# EAGLE design unicycle_v2.3 (EAGLE 9.6.1)
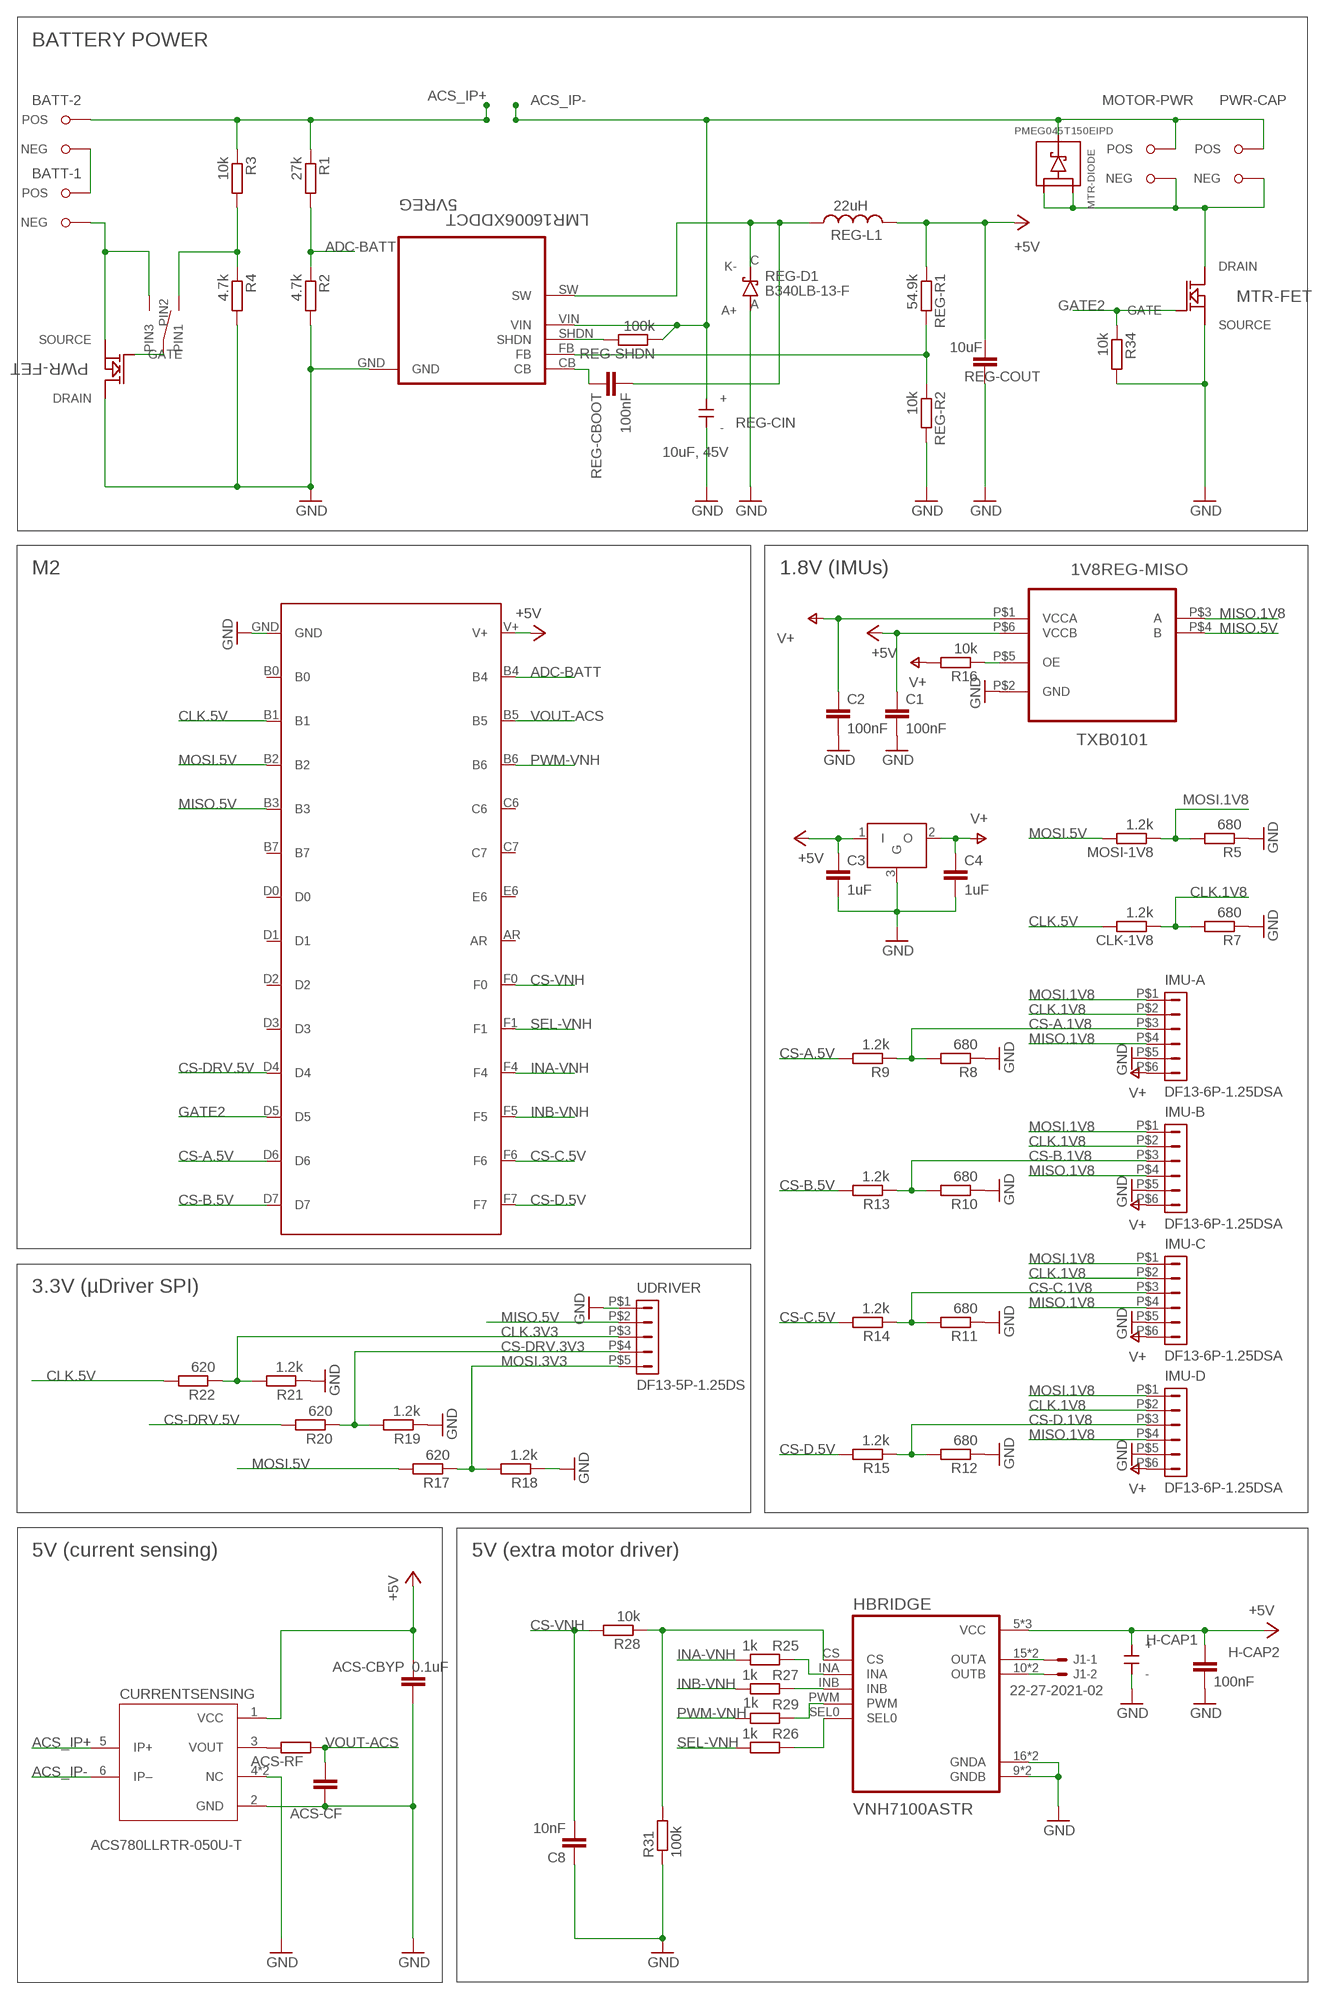
[diagram p0: schematic, sheet 1]

## Parts
1V8-REG  AP7333AG  [SOT23]
1V8REG-MISO  TXB0101  [SOT23-6]
5VREG  LMR16006XDDCT  [SOT95P280X110-6N]
ACS-CBYP  0.1uF  C-EUC0603  [C0603]
ACS-CF  C-EUC0603  [C0603]
ACS-RF  R-EU_R0603  [R0603]
C1  100nF  C-EUC0402  [C0402]
C2  100nF  C-EUC0402  [C0402]
C3  1uF  C-EUC0402  [C0402]
C4  1uF  C-EUC0402  [C0402]
C8  10nF  C-EUC0402  [C0402]
CLK-1V8  1.2k  R-EU_R0402  [R0402]
CURRENTSENSING  ACS780LLRTR-050U-T  [XDCR_ACS780LLRTR-050B-T]
H-CAP1  TPSD337K006R0045  [AVX_TPS-D]
H-CAP2  100nF  C-EUC0402  [C0402]
HBRIDGE  VNH7100ASTR  [SOIC127P600X175-16N]
IMU-A  DF13-6P-1.25DSA  [DF13-6P-1.25DSA]
IMU-B  DF13-6P-1.25DSA  [DF13-6P-1.25DSA]
IMU-C  DF13-6P-1.25DSA  [DF13-6P-1.25DSA]
IMU-D  DF13-6P-1.25DSA  [DF13-6P-1.25DSA]
J1  22-27-2021-02  [6410-02]
MOSI-1V8  1.2k  R-EU_R0402  [R0402]
MOTOR-PWR  21AWG_X2  [21AWG_X2]
MTR-DIODE  PMEG045T150EIPD  [PMEG045T150EIPD]
MTR-FET  CSD18540Q5BT  [DNK0008A]
PWR-CAP  21AWG_X2  [21AWG_X2]
PWR-FET  CSD18540Q5BT  [DNK0008A]
R1  27k  R-EU_R0402  [R0402]
R2  4.7k  R-EU_R0402  [R0402]
R3  10k  R-EU_R0402  [R0402]
R4  4.7k  R-EU_R0402  [R0402]
R5  680  R-EU_R0402  [R0402]
R7  680  R-EU_R0402  [R0402]
R8  680  R-EU_R0402  [R0402]
R9  1.2k  R-EU_R0402  [R0402]
R10  680  R-EU_R0402  [R0402]
R11  680  R-EU_R0402  [R0402]
R12  680  R-EU_R0402  [R0402]
R13  1.2k  R-EU_R0402  [R0402]
R14  1.2k  R-EU_R0402  [R0402]
R15  1.2k  R-EU_R0402  [R0402]
R16  10k  R-EU_R0402  [R0402]
R17  620  R-EU_R0402  [R0402]
R18  1.2k  R-EU_R0402  [R0402]
R19  1.2k  R-EU_R0402  [R0402]
R20  620  R-EU_R0402  [R0402]
R21  1.2k  R-EU_R0402  [R0402]
R22  620  R-EU_R0402  [R0402]
R25  1k  R-EU_R0402  [R0402]
R26  1k  R-EU_R0402  [R0402]
R27  1k  R-EU_R0402  [R0402]
R28  10k  R-EU_R0402  [R0402]
R29  1k  R-EU_R0402  [R0402]
R31  100k  R-EU_R0402  [R0402]
R34  10k  R-EU_R0402  [R0402]
REG-CBOOT  100nF  C-EUC0402  [C0402]
REG-CIN  10uF, 45V  TCJD106M050R0120  [TCJD106M050R0120]
REG-COUT  10uF  C-EUC0603  [C0603]
REG-D1  B340LB-13-F  [DIODES-SMB]
REG-L1  22uH  IND-LHMI  [4020]
REG-R1  54.9k  R-EU_R0402  [R0402]
REG-R2  10k  R-EU_R0402  [R0402]
REG-SHDN  100k  R-EU_R0402  [R0402]
SWITCH  ATE1D-2M3-10-Z  [ATE1D-2M3-10-Z]
U$2  M2  [M1]
U$8  XT30PW-M  [XT30PW-M-NOHOLE]
U$9  XT30PW-M  [XT30PW-M-NOHOLE]
UDRIVER  DF13-5P-1.25DS  [DF13-5P-1.25DS]

## Nets
+5V: 1V8-REG.1(I) 1V8REG-MISO.P$6(VCCB) ACS-CBYP.2 C1.1 C3.1 CURRENTSENSING.1(VCC) H-CAP1.POS(+) H-CAP2.1 HBRIDGE.5(VCC) HBRIDGE.12(VCC) HBRIDGE.VCC REG-COUT.1 REG-L1.P$2 REG-R1.1 U$2.V+
ACS_IP+: CURRENTSENSING.5(IP+) R1.1 R3.1 U$8.POS
ACS_IP-: 5VREG.VIN CURRENTSENSING.6(IP–) MOTOR-PWR.POS MTR-DIODE.3(K) PWR-CAP.POS REG-CIN.POS(+) REG-SHDN.1
ADC-BATT: R1.2 R2.1 U$2.B4
CLK.1V8: CLK-1V8.1 IMU-A.P$2 IMU-B.P$2 IMU-C.P$2 IMU-D.P$2 R7.2
CLK.3V3: R21.2 R22.1 UDRIVER.P$3
CLK.5V: CLK-1V8.2 R22.2 U$2.B1
CS-A.1V8: IMU-A.P$3 R8.2 R9.1
CS-A.5V: R9.2 U$2.D6
CS-B.1V8: IMU-B.P$3 R10.2 R13.1
CS-B.5V: R13.2 U$2.D7
CS-C.1V8: IMU-C.P$3 R11.2 R14.1
CS-C.5V: R14.2 U$2.F6
CS-D.1V8: IMU-D.P$3 R12.2 R15.1
CS-D.5V: R15.2 U$2.F7
CS-DRV.3V3: R19.2 R20.1 UDRIVER.P$4
CS-DRV.5V: R20.2 U$2.D4
CS-VNH: C8.2 R28.2 U$2.F0
GATE2: MTR-FET.4(GATE) R34.1 U$2.D5
GND: 1V8-REG.3(G) 1V8REG-MISO.P$2(GND) 5VREG.GND ACS-CBYP.1 ACS-CF.2 C1.2 C2.2 C3.2 C4.2 C8.1 CURRENTSENSING.2(GND) CURRENTSENSING.4(NC) CURRENTSENSING.7(NC) H-CAP1.NEG(-) H-CAP2.2 HBRIDGE.9(GNDB) HBRIDGE.16(GNDA) HBRIDGE.GNDA HBRIDGE.GNDB IMU-A.P$5 IMU-B.P$5 IMU-C.P$5 IMU-D.P$5 MTR-FET.1(SOURCE) MTR-FET.2(SOURCE) MTR-FET.3(SOURCE) PWR-FET.9(DRAIN) R2.2 R4.2 R5.1 R7.1 R8.1 R10.1 R11.1 R12.1 R18.1 R19.1 R21.1 R31.1 R34.2 REG-CIN.NEG(-) REG-COUT.2 REG-D1.A(A+) REG-R2.2 U$2.GND UDRIVER.P$1
INA-VNH: R25.2 U$2.F4
INB-VNH: R27.2 U$2.F5
MISO.1V8: 1V8REG-MISO.P$3(A) IMU-A.P$4 IMU-B.P$4 IMU-C.P$4 IMU-D.P$4
MISO.5V: 1V8REG-MISO.P$4(B) U$2.B3 UDRIVER.P$2
MOSI.1V8: IMU-A.P$1 IMU-B.P$1 IMU-C.P$1 IMU-D.P$1 MOSI-1V8.1 R5.2
MOSI.3V3: R17.1 R18.2 UDRIVER.P$5
MOSI.5V: MOSI-1V8.2 R17.2 U$2.B2
N$1: 5VREG.SHDN REG-SHDN.2
N$2: HBRIDGE.15(OUTA) HBRIDGE.OUTA J1.1
N$3: MOTOR-PWR.NEG MTR-DIODE.1(A1) MTR-DIODE.2(A2) MTR-FET.9(DRAIN) PWR-CAP.NEG
N$4: 5VREG.FB REG-R1.2 REG-R2.1
N$5: 5VREG.SW REG-CBOOT.1 REG-D1.C(K-) REG-L1.P$1
N$6: 5VREG.CB REG-CBOOT.2
N$7: 1V8REG-MISO.P$5(OE) R16.1
N$8: U$8.NEG U$9.POS
N$9: PWR-FET.1(SOURCE) PWR-FET.2(SOURCE) PWR-FET.3(SOURCE) SWITCH.P$3(PIN3) U$9.NEG
N$10: R3.2 R4.1 SWITCH.P$1(PIN1)
N$11: HBRIDGE.INB R27.1
N$12: HBRIDGE.SEL0 R26.1
N$13: HBRIDGE.PWM R29.1
N$14: PWR-FET.4(GATE) SWITCH.P$2(PIN2)
N$15: HBRIDGE.CS R28.1 R31.2
N$18: ACS-RF.2 CURRENTSENSING.3(VOUT)
N$19: HBRIDGE.10(OUTB) HBRIDGE.OUTB J1.2
N$20: HBRIDGE.INA R25.1
PWM-VNH: R29.2 U$2.B6
SEL-VNH: R26.2 U$2.F1
V+: 1V8-REG.2(O) 1V8REG-MISO.P$1(VCCA) C2.1 C4.1 IMU-A.P$6 IMU-B.P$6 IMU-C.P$6 IMU-D.P$6 R16.2
VOUT-ACS: ACS-CF.1 ACS-RF.1 U$2.B5
Unconnected: U$2.AR U$2.B0 U$2.B7 U$2.C6 U$2.C7 U$2.D0 U$2.D1 U$2.D2 U$2.D3 U$2.E6

## Notes on the sheet
- BATTERY POWER
- BATT-2
- BATT-1
- M2 | 1.8V (IMUs)
- 3.3V (µDriver SPI)
- 5V (current sensing) | 5V (extra motor driver)

## Library data of the parts
1V8-REG = zz-MPI:AP7333AG
1V8REG-MISO = zz-MPI:TXB0101
5VREG = zz-nkt-parts:LMR16006: Buck Regulator; MF: Texas Instruments; PACKAGE: SOT-23-THN-6 Texas Instruments; PART_NO_DIGI: 296-38546-1-ND; PART_NO_MFR: LMR16006XDDCT; PART_NO_RS: 914-2986
ACS-CBYP ACS-CF = resistor:C-EU: CAPACITOR, European symbol
ACS-RF = resistor:R-EU_: RESISTOR, European symbol
C1-C4 C8 H-CAP2 REG-CBOOT REG-COUT = zz-jpf:C-EU: CAPACITOR, European symbol
CLK-1V8 MOSI-1V8 R1-R5 R7-R22 R25-R29 R31 R34 REG-R1 REG-R2 REG-SHDN = zz-jpf:R-EU_: RESISTOR, European symbol
CURRENTSENSING = zz-nkt-parts:ACS780LLRTR-: Hall Effect Sensor; MF: Allegro MicroSystems LLC; PACKAGE: PowerSMD-7 Allegro MicroSystems LLC; PART_NO_MFR: ACS780LLRTR-050U-T; PART_NO_RS: 146-4456
H-CAP1 = zz-nkt-parts:TPSD337K006R0045: Capacitor 330uF 6.3V; LINK_DIGI: https://www.digikey.com/en/products/detail/avx-corporation/TPSD337K006R0045/929946; LINK_RS: https://de.rs-online.com/web/p/tantal-elektrolytkondensator/1359982/; MF: AVX Corporation; NOTES: 330μF, 6.3V dc; PART_NO_DIGI: 478-3314-1-ND; PART_NO_MFR: TPSD337K006R0045; PART_NO_RS: 135-9982
HBRIDGE = zz-nkt-parts:VNH7100ASTR: Motor Driver; MF: STMicroelectronics; PACKAGE: SOIC-16 STMicroelectronics; PART_NO_DIGI: 497-17629-1-ND; PART_NO_MFR: VNH7100ASTR
IMU-A IMU-B IMU-C IMU-D = con-hirose-df13:DF13-6P-1.25: DF13-6P 1.25mm Pitch Miniature Crimping Connector.
J1 = con-molex:22-?-02: CONNECTOR wire to board 2.54 mm (.1 inch) pitch header; MF: MOLEX; OC_FARNELL: unknown; OC_NEWARK: unknown
MOTOR-PWR PWR-CAP = zz-nkt-parts:21AWG_X2: through hole for 21? AWG wire
MTR-DIODE = zz-nkt-parts:PMEG045T150EIPD: Diode 45V 15A; LINK_DIGI: https://www.digikey.de/product-detail/de/nexperia-usa-inc/PMEG045T150EIPDZ/1727-8328-1-ND/9520869; MF: Nexperia USA Inc.; PART_NO_DIGI: 1727-8328-1-ND; PART_NO_MFR: PMEG045T150EIPD; PART_NO_RS: n/a; REF: https://assets.nexperia.com/documents/data-sheet/PMEG045T150EIPD.pdf
MTR-FET PWR-FET = zz-nkt-parts:CSD18540Q5BT: Power MOSFET; LINK_DIGI: https://www.digikey.de/product-detail/en/texas-instruments/CSD18540Q5BT/296-37963-1-ND/4915650; MF: Texas Instruments; PART_NO_DIGI: 296-37963-1-ND; PART_NO_MFR: CSD18540Q5BT; REF: http://www.ti.com/lit/ds/symlink/csd18540q5b.pdf
REG-CIN = zz-nkt-parts:TCJD106M050R0120: Capacitor 10uF 50V; LINK_DIGI: https://www.digikey.com/en/products/detail/avx-corporation/TCJD106M050R0120/2578345; LINK_RS: https://de.rs-online.com/web/p/tantal-elektrolytkondensator/1442463/; MF: AVX; NOTES: rated 10uF, 50V; PART_NO_DIGI: 478-6492-1-ND; PART_NO_MFR: TCJD106M050R0120; PART_NO_RS: 144-2463; REF: https://docs.rs-online.com/b14b/0900766b815de27f.pdf
REG-D1 = zz-nkt-parts:B340LB-13-F: Schottky diode; LINK_RS: https://de.rs-online.com/web/p/schottky-diodes-rectifiers/9228115/; MF: DiodesZetex; PART_NO_MFR: B340LB-13-F; PART_NO_RS: 922-8115
REG-L1 = zz-nkt-parts:IND-LHMI: Inductor 22uH; LINK_RS: https://de.rs-online.com/web/p/multilayer-surface-mount-inductors/7568496/; MF: Wurth Elektronik; PART_NO_MFR: 74437324220; PART_NO_RS: 756-8496
SWITCH = zz-nkt-parts:ATE1D-2M3-10-Z: Switch; LINK_RS: https://my.rs-online.com/web/p/toggle-switches/0222516/; MF: nidec copal electronics; NOTES: Made the lead drill hole size 1mm as per recommendation by Felix; PART_NO_MFR: ATE1D-2M3-10-Z; PART_NO_RS: 222-516; REF: https://www.nidec-copal-electronics.com/e/catalog/switch/ate.pdf
U$2 = zz-upenn:M2
U$8 U$9 = zz-nkt-parts:XT30PW-M
UDRIVER = con-hirose-df13:DF13-5P-1.25: DF13-5P 1.25mm Pitch Miniature Crimping Connector.

## Board
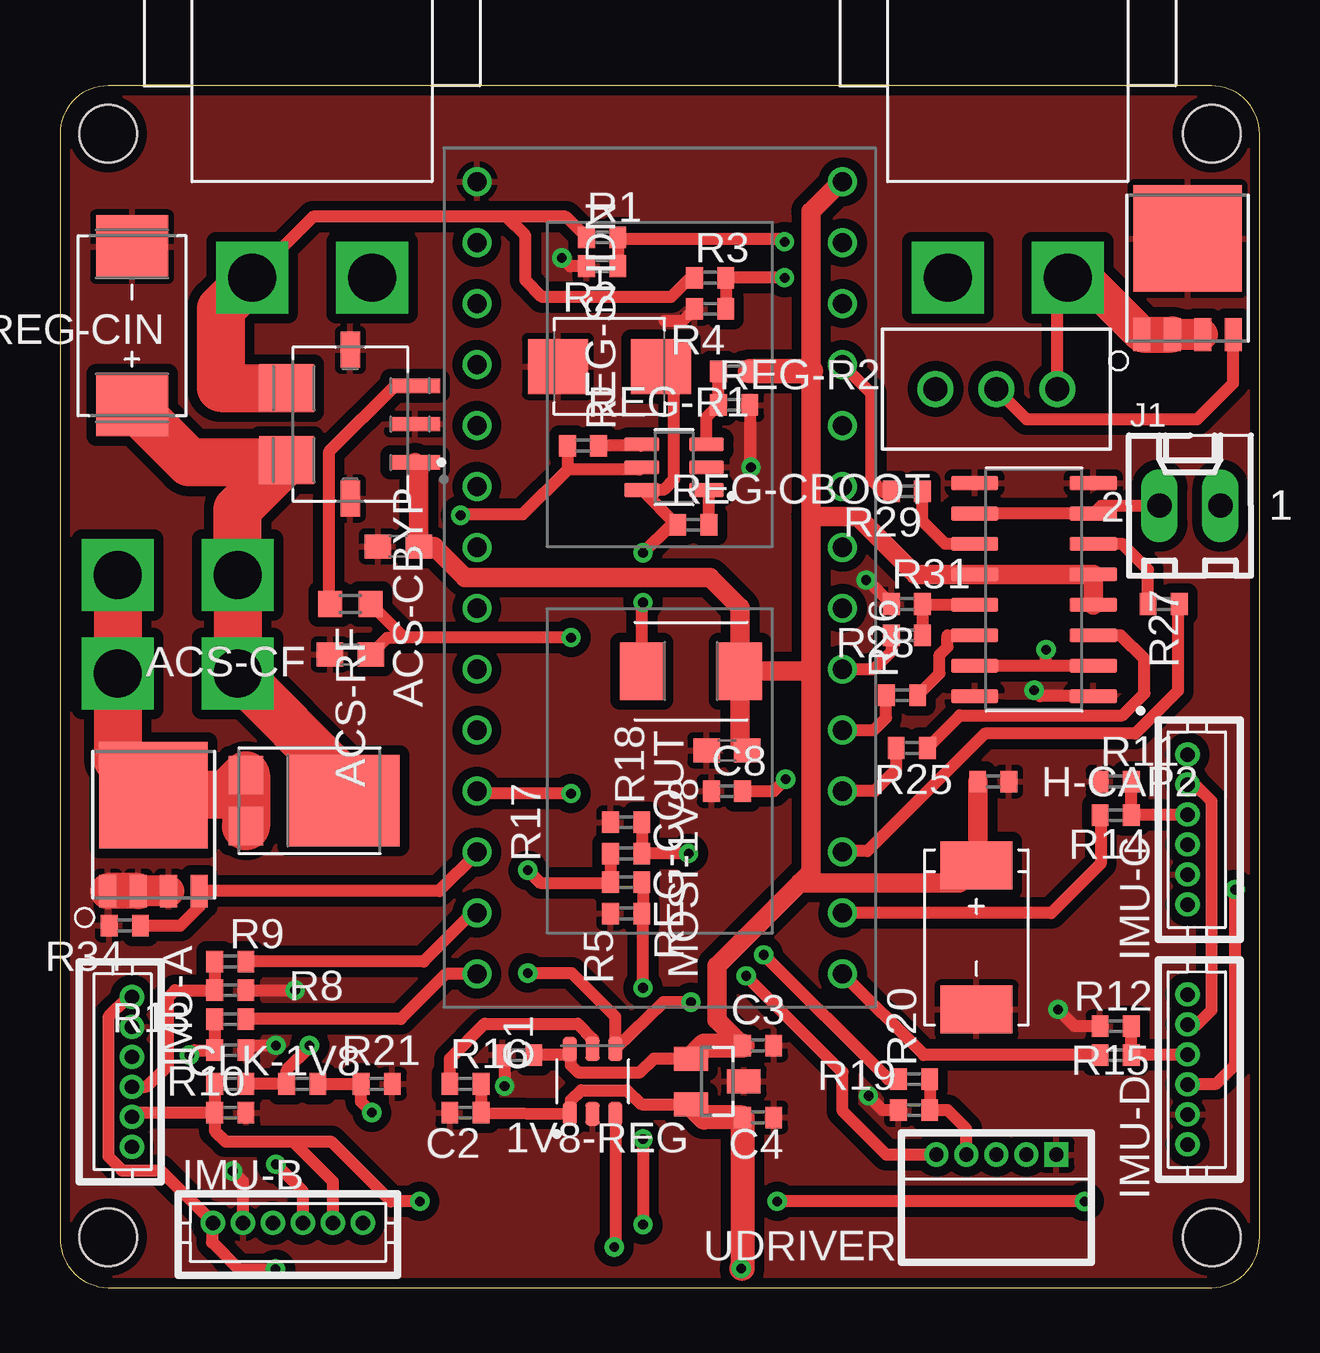
[diagram p1: board, top side]
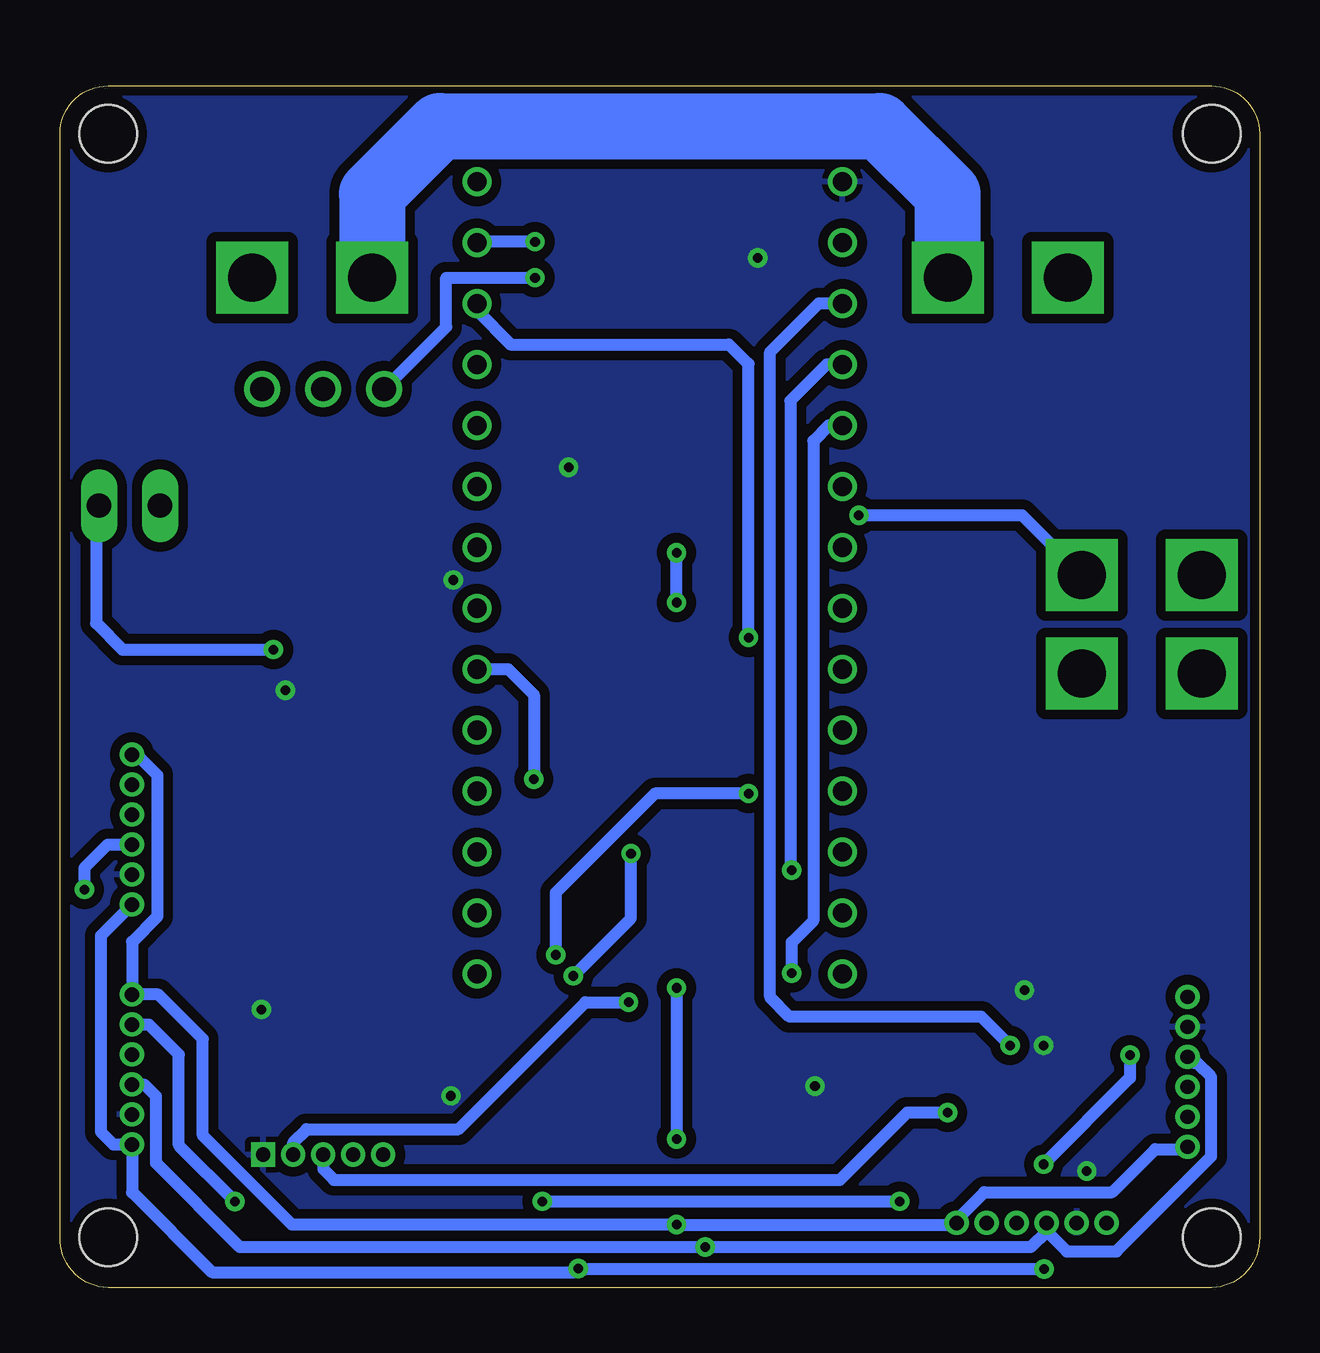
[diagram p2: board, bottom side, seen from below]

Size 50 x 50.1 mm. Coordinates in mm from the lower left corner, seen from the top.
Outline: 0,48.1 0,2.1 arc90 2,0 48,0 arc90 50,2.1 50,48.1 arc90 48,50.1 2,50.1 arc90 0,48.1
Copper layers (1*16): Top 0.07mm / dielectric 1.5mm / Bottom 0.07mm
Design rules "default *": minimum track width 0.5mm, minimum drill 0.4mm, track to track 9mil, track to pad 9mil, pad to pad 9mil, via to via 9mil, smd to smd 6mil, copper to edge 0.3mm, drill to drill 6mil, minimum pad ring 8mil, minimum via ring 8mil, stop-mask expansion 4mil, vias tented up to drill 0mil, thermal gap 10mil
Holes 2.4 mm at 2,48.1 2,2.1 48,2.1 48,48.1

### Footprints (pad centres in the part's own frame; a part is rotated, then mirrored left to right if it is on the bottom)
SOT23 = smd 1 x 1.4: 1 -0.95,-1.1; 2 0.95,-1.1; 3 0,1.1
SOT23-6 = smd 1 x 0.6: P$1 -1.35,0.95; P$2 -1.35,0; P$3 -1.35,-0.95; P$4 1.35,-0.95; P$5 1.35,0; P$6 1.35,0.95
SOT95P280X110-6N = smd 1.45 x 0.59: CB -1.35,0.95; FB -1.35,-0.95; GND -1.35,0; SHDN 1.35,-0.95; SW 1.35,0.95; VIN 1.35,0
C0603 = smd 1.1 x 1: 1 -0.85,0; 2 0.85,0
R0603 = smd 1 x 1.1: 1 -0.85,0; 2 0.85,0
C0402 = smd 0.7 x 0.9: 1 -0.65,0; 2 0.65,0
R0402 = smd 0.7 x 0.9: 1 -0.65,0; 2 0.65,0
XDCR_ACS780LLRTR-050B-T = smd 2.1 x 0.6: 1 -2.7,1.6; 2 -2.7,0; 3 -2.7,-1.6 | smd 0.8 x 1.5: 4 0,-3.1; 7 0,3.1 | smd 2.3 x 2: 5 2.65,-1.5; 6 2.65,1.5
AVX_TPS-D = smd 2 x 3: NEG -3,0; POS 3,0
SOIC127P600X175-16N = smd 1.97 x 0.6: 5 -2.475,-0.635; 9 2.475,-4.445; 10 2.475,-3.175; 12 2.475,-0.635; 15 2.475,3.175; 16 2.475,4.445; CS 2.475,0.635; GNDA -2.475,4.445; GNDB -2.475,-4.445; INA -2.475,1.905; INB -2.475,-1.905; OUTA -2.475,3.175; OUTB -2.475,-3.175; PWM 2.475,-1.905; SEL0 2.475,1.905; VCC -2.475,0.635
DF13-6P-1.25DSA = drill 0.6 pad 0.864: P$1 3.125,0; P$2 1.875,0; P$3 0.625,0; P$4 -0.625,0; P$5 -1.875,0; P$6 -3.125,0
6410-02 = drill 1.016 long: 1 1.27,0; 2 -1.27,0
21AWG_X2 = drill 2 square: NEG 2.5,0; POS -2.5,0
PMEG045T150EIPD = smd 1.6 x 1.44: 1 1.065,2.65; 2 -1.065,2.65 | smd 3.8 x 4.7: 3 0,-1.41
DNK0008A = smd 1.372 x 0.71: 1 2.77,-1.905; 2 2.77,-0.635; 3 2.77,0.635; 4 2.77,1.905 | smd 4.44 x 4.52: 9 -1.236,0
TCJD106M050R0120 = smd 2.6 x 3: NEG 3.3,0; POS -3.3,0
DIODES-SMB = smd 2.5 x 2.3: A 2.15,0; C -2.15,0
4020 = smd 1.8 x 2.4: P$1 2.05,0; P$2 -2.05,0
ATE1D-2M3-10-Z = drill 1: P$1 -2.54,0; P$2 0,0; P$3 2.54,0
M1 = drill 0.8: AR 7.62,-17.78; B0 -7.62,-2.54; B1 -7.62,-5.08; B2 -7.62,-7.62; B3 -7.62,-10.16; B4 7.62,-2.54; B5 7.62,-5.08; B6 7.62,-7.62; B7 -7.62,-12.7; C6 7.62,-10.16; C7 7.62,-12.7; D0 -7.62,-15.24; D1 -7.62,-17.78; D2 -7.62,-20.32; D3 -7.62,-22.86; D4 -7.62,-25.4; D5 -7.62,-27.94; D6 -7.62,-30.48; D7 -7.62,-33.02; E6 7.62,-15.24; F0 7.62,-20.32; F1 7.62,-22.86; F4 7.62,-25.4; F5 7.62,-27.94; F6 7.62,-30.48; F7 7.62,-33.02; GND -7.62,0; V+ 7.62,0
XT30PW-M-NOHOLE = drill 2 square: NEG 2.5,0; POS -2.5,0
DF13-5P-1.25DS = drill 0.6 pad 1.016 square: P$1 2.5,0 | drill 0.6 pad 1.016: P$2 1.25,0; P$3 0,0; P$4 -1.25,0; P$5 -2.5,0

### Placement (x,y rotation side)
1V8-REG  27.4,8.6 270 top
1V8REG-MISO  22.2,8.6 90 top
5VREG  25.6,34.2 180 top
ACS-CBYP  14.1,30.9 0 top
ACS-CF  12.1,26.4 180 top
ACS-RF  12.1,28.5 180 top
C1  19.1,9.7 180 top
C2  16.9,7.3 180 top
C3  29.1,10.1 0 top
C4  29.1,7.1 0 top
C8  27.8,20.7 0 top
CLK-1V8  7.1,8.5 0 top
CURRENTSENSING  12.1,36 180 top
H-CAP1  38.2,14.6 90 top
H-CAP2  38.9,21.1 0 top
HBRIDGE  40.6,29.1 180 top
IMU-A  3,9 270 top
IMU-B  9.5,2.7 0 top
IMU-C  47,19.1 90 top
IMU-D  47,9.1 90 top
J1  47.1,32.6 0 top
MOSI-1V8  23.6,16.9 180 top
MOTOR-PWR  4.9,25.6 180 top
MTR-DIODE  10.4,20.3 90 top
MTR-FET  3.9,19.3 270 top
PWR-CAP  4.9,29.7 180 top
PWR-FET  47,42.5 270 top
R1  22.6,43.78 0 top
R2  22.6,42.58 180 top
R3  27.1,42.1 0 top
R4  27.1,40.8 180 top
R5  23.6,15.6 0 top
R7  7.1,7.3 180 top
R8  7.1,12.4 180 top
R9  7.1,13.6 0 top
R10  7.1,9.9 180 top
R11  44,21.1 0 top
R12  44,10.9 0 top
R13  7.1,11.2 0 top
R14  44,19.7 180 top
R15  44,9.7 180 top
R16  16.9,8.5 0 top
R17  23.6,18.1 180 top
R18  23.6,19.4 0 top
R19  35.6,7.4 0 top
R20  35.6,8.7 180 top
R21  13.2,8.5 180 top
R22  10.1,8.5 180 top
R25  35.5,22.5 180 top
R26  35.1,24.7 180 top
R27  46,28.5 0 top
R28  35.3,27.2 180 top
R29  35.3,33.2 180 top
R31  35.3,28.5 0 top
R34  2.7,15.1 180 top
REG-CBOOT  26.4,31.8 0 top
REG-CIN  3,40.1 90 top
REG-COUT  27.8,22.4 180 top
REG-D1  22.9,38.4 180 top
REG-L1  26.3,25.7 180 top
REG-R1  28.1,38.2 180 top
REG-R2  28.1,36.8 0 top
REG-SHDN  21.8,35.1 0 top
SWITCH  39.03,37.46 0 top
U$2  25,46.1 0 top
U$8  10.5,42.1 0 top
U$9  39.5,42.1 0 top
UDRIVER  39.03,5.55 0 top

### Tracks (layer width: path | path; a pad name or v marks a point on that pad's centre or on a via)
+5V
  Top 0.5: 1V8-REG.1 24.75,9.55 24.15,8.96 21.62,8.96 21.3,9.27 21.3,9.85 1V8REG-MISO.P$6 21.05,9.7 C1.1
  Top 0.813: HBRIDGE.VCC HBRIDGE.5 HBRIDGE.12 35.66,29.74 33.24,32.15 31.3,32.15 | U$2.V+ 32.55,46.1 31.3,44.86 31.3,38.2 31.3,32.15 | H-CAP2.1 38.25,17.65 H-CAP1.POS 37.48,16.88 30.84,16.88 | C3.1 27.38,11.17 27.38,13.42 30.84,16.88 | 30.84,16.88 31.3,17.34 31.3,25.7 | CURRENTSENSING.1 14.95,34.25 ACS-CBYP.2 15.59,30.9 16.89,29.6 27.1,29.6 28.35,28.35 REG-L1.P$2 | 31.3,32.15 31.3,25.7 | REG-L1.P$2 31.3,25.7 | REG-COUT.1 28.35,22.7 REG-L1.P$2
  Top 1: 1V8-REG.1 26.85,10.1 C3.1
  Top 1.016: REG-R1.1 31.3,38.2
ACS_IP+
  Top 0.5: R1.1 21.09,44.64 18.6,44.64 | 18.6,44.64 10.54,44.64 U$8.POS | R3.1 26.27,42.1 25.47,41.3 20.1,41.3 19.4,42 19.4,43.84 18.6,44.64
  Top 2: U$8.POS 6.7,40.8 6.7,37.5 CURRENTSENSING.5
ACS_IP-  (via drill 0.4)
  Top 0.5: v16.7,32.2 16.74,32.24 19.29,32.24 21.15,34.1 | REG-SHDN.1 21.15,34.1 | 5VREG.VIN 24.15,34.1 21.15,34.1
  Top 2: REG-CIN.POS 5.4,34.4 9.35,34.4 CURRENTSENSING.6 7.4,32.45 PWR-CAP.POS MOTOR-PWR.POS 11.81,21.19 MTR-DIODE.3
  Bottom 0.5: v16.7,32.2 9.9,32.2 PWR-CAP.POS
ADC-BATT  (via drill 0.4)
  Top 0.5: R2.1 R1.2 23.33,43.7 30.1,43.7 v30.2,43.6
  Bottom 0.5: v30.2,43.6 32.58,43.6 U$2.B4
CLK.1V8  (via drill 0.4)
  Top 0.5: 3.11,7.23 IMU-A.P$2 3.17,7.3 R7.2 | IMU-D.P$2 47.4,10.97 48,11.57 48,20.28 47.6,20.68 47.59,20.68 47.3,20.98 IMU-C.P$2 | v42.7,3.6 v29.9,3.6 | v15,3.6 13.8,3.6 11.3,6.1 9.7,6.1 | CLK-1V8.1 R7.2 | R7.2 6.45,6.55 6.9,6.1 9.7,6.1 | IMU-B.P$2 11.38,4.42 9.7,6.1
  Bottom 0.5: IMU-D.P$2 46.3,10.97 45.05,9.72 45.05,5.94 v42.7,3.6 | v29.9,3.6 v15,3.6
CLK.3V3  (via drill 0.4)
  Top 0.5: v13,7.3 12.55,7.75 R21.2 R22.1
  Bottom 0.5: UDRIVER.P$3 39.03,4.95 38.58,4.49 17.5,4.49 14.69,7.3 v13,7.3
CLK.5V  (via drill 0.4)
  Top 0.5: CLK-1V8.2 R22.2 9.45,9.08 10.4,10.03 v10.4,10.1
  Bottom 0.5: U$2.B1 18.38,41.02 20.4,39 20.4,12.12 19.59,11.3 11.6,11.3 v10.4,10.1
CS-A.1V8
  Top 0.5: R9.1 6.45,12.44 6.36,12.35 R8.2 4.8,12.4 4.5,12.1 4.5,9.28 3.6,8.38 IMU-A.P$3
CS-A.5V
  Top 0.5: U$2.D6 17.18,15.62 15.16,13.6 R9.2
CS-B.1V8  (via drill 0.4)
  Top 0.5: R13.1 R10.2 5.6,9.9 v5.4,9.7 | IMU-B.P$3 10.12,4.02 v9,5.14
  Bottom 0.5: v9,5.14 5.4,8.74 v5.4,9.7
CS-B.5V
  Top 0.5: U$2.D7 16.08,13.08 14.2,11.2 R13.2
CS-C.1V8
  Top 0.5: IMU-C.P$3 46.98,19.7 R14.1 R11.2
CS-C.5V
  Top 0.5: R14.2 43.38,19.67 43.38,17.68 41.31,15.62 U$2.F6
CS-D.1V8
  Top 0.5: IMU-D.P$3 46.98,9.7 R15.1 R12.2
CS-D.5V
  Top 0.5: R15.2 36,9.7 U$2.F7
CS-DRV.3V3
  Top 0.5: UDRIVER.P$4 37.78,6.62 37,7.4 R19.2 R20.1
CS-DRV.5V  (via drill 0.4)
  Top 0.5: v21.3,20.6 17.48,20.6 U$2.D4 | R20.2 34.5,8.7 v29.33,13.87
  Bottom 0.5: v29.33,13.87 29.33,16.47 25.2,20.6 v21.3,20.6
CS-VNH  (via drill 0.4)
  Top 0.5: U$2.F0 33.92,25.78 34.65,26.51 R28.2 | v30.25,21.2 29.75,20.7 C8.2
  Bottom 0.5: U$2.F0 31.32,25.78 30.25,24.71 v30.25,21.2
GATE2
  Top 0.5: U$2.D5 17.38,18.11 15.8,16.53 MTR-FET.4 5.8,15.88 5.02,15.1 R34.1
GND  (via drill 0.4)
  Top 0.5: C1.2 18.53,9.62 v18.53,8.4 | R19.1 34.3,7.4 v33.7,8 | IMU-B.P$5 7.62,4.44 v7.2,4.87 | R12.1 42.3,10.9 v41.6,11.6 | HBRIDGE.GNDA 40.84,24.66 v40.6,24.9 | REG-R2.2 28.75,34.25 v28.8,34.2 | R8.1 v9.8,12.4 | R10.1 7.95,10.1 v9,10.1 | R31.1 33.65,29.5 v33.6,29.5 | R2.2 21.27,42.58 v20.92,42.92 | R4.2 25.95,40.3 25.2,40.3
  Top 1.3: MTR-FET.3 MTR-FET.2
  Top 1.5: MTR-FET.2 MTR-FET.1
  pour Top (isolate 0.406): 0,-0.2 50.8,-0.2 50.8,50.9 0,50.9
  pour Bottom (isolate 0.406): 0,-0.2 50.8,-0.2 50.8,51.2 0,51.2
INA-VNH
  Top 0.5: R25.2 34.85,21.6 33.95,20.7 U$2.F4
INB-VNH
  Top 0.5: R27.2 46.6,28.45 46.6,24.88 44.82,23.1 38.55,23.1 33.65,18.2 32.66,18.2 U$2.F5
MISO.1V8  (via drill 0.4)
  Top 0.5: IMU-D.P$4 47.02,8.5 48.2,8.5 48.98,9.28 v48.98,16.6 | 1V8REG-MISO.P$3 23.15,1.75 v23.1,1.7
  Bottom 0.5: IMU-C.P$4 48,18.48 48.98,17.5 v48.98,16.6 | IMU-D.P$4 46.5,8.47 46,7.98 46,5.2 42.5,1.7 v23.1,1.7 9.54,1.7 8.88,2.36 | IMU-B.P$4 8.88,2.36 | 8.88,2.36 8.03,1.52 5.97,1.52 2.02,5.47 2.02,8.78 2.59,9.36 2.73,9.36 IMU-A.P$4
MISO.5V  (via drill 0.4)
  Top 0.5: v19.5,13.12 21.33,13.12 23.15,11.3 1V8REG-MISO.P$4 25.15,11.9 v26.3,11.9
  Bottom 0.5: UDRIVER.P$2 40.28,6.05 39.73,6.61 33.39,6.61 28.1,11.9 v26.3,11.9 | U$2.B3 17.96,35.94 18.6,35.3 18.6,15.3 19.5,14.4 v19.5,13.12
MOSI.1V8  (via drill 0.4)
  Top 0.5: v24.3,6.2 v24.3,2.63 | 24.3,15.55 R5.2 | v24.3,12.5 24.3,15.55 | MOSI-1V8.1 24.3,16.85 24.3,15.55
  Bottom 0.5: IMU-A.P$1 3,5.78 4.35,5.78 6.14,3.99 11.48,3.99 12.62,2.84 IMU-B.P$1 12.7,2.63 v24.3,2.63 40.33,2.63 44.04,6.34 44.04,10.37 45.9,12.22 IMU-D.P$1 47,14.42 45.94,15.48 45.94,21.37 46.8,22.23 IMU-C.P$1 | v24.3,12.5 v24.3,6.2
MOSI.3V3  (via drill 0.4)
  Top 0.5: UDRIVER.P$5 34.45,5.55 32.62,7.38 32.62,8.98 v28.6,13 | R18.2 R17.1 v26.2,18.1
  Bottom 0.5: v28.6,13 26.2,15.4 v26.2,18.1
MOSI.5V  (via drill 0.4)
  Top 0.5: v19.5,17.4 20,16.88 22.93,16.88 MOSI-1V8.2 R17.2
  Bottom 0.5: v19.5,17.4 19.55,17.47 19.55,36.97 18.04,38.48 U$2.B2
N$1
  Top 0.5: 5VREG.SHDN 24.2,35.1 REG-SHDN.2
N$2  (via drill 0.4)
  Top 0.5: HBRIDGE.OUTA 41.1,25.93 | 41.1,25.93 HBRIDGE.15 | 41.1,25.93 v41.1,26.6
  Bottom 0.5: J1.1 48.5,32.47 48.5,27.7 47.4,26.6 v41.1,26.6
N$3
  Top 2: PWR-CAP.NEG MOTOR-PWR.NEG 2.4,22.04 MTR-FET.9 6.92,20.54 MTR-DIODE.1 MTR-DIODE.2
N$4
  Top 0.5: 5VREG.FB 26.95,36.3 REG-R2.1 REG-R1.2
N$5  (via drill 0.4)
  Top 0.5: REG-D1.C 25.6,37.85 25.6,33.7 25.15,33.25 5VREG.SW 25.7,31.8 | 25.7,31.8 REG-CBOOT.1 | REG-L1.P$1 24.25,28.51 v24.3,28.56 | v24.3,30.64 25.46,31.8 25.7,31.8
  Bottom 0.5: v24.3,28.56 v24.3,30.64
N$6
  Top 0.5: REG-CBOOT.2 27.05,33.15 5VREG.CB
N$7
  Top 0.5: 1V8REG-MISO.P$5 22.23,9.98 22.23,10.36 21.59,11 17.7,11 16.25,9.55 R16.1
N$8
  Bottom 2.75: U$8.NEG 13,45.6 15.82,48.43 34.17,48.43 37,45.6 U$9.POS
N$9
  Top 0.5: SWITCH.P$3 41.57,41.67 U$9.NEG
  Top 1.3: PWR-FET.3 PWR-FET.2
  Top 1.5: U$9.NEG 42.73,42.1 PWR-FET.1 PWR-FET.2
N$10  (via drill 0.4)
  Top 0.5: R4.1 R3.2 v30.2,42.1
  Bottom 0.5: SWITCH.P$1 33.9,40.05 33.9,42.1 33.07,42.1 32.17,42.1 v30.2,42.1
N$11
  Top 0.5: R27.1 45.35,29.93 44.27,31.01 HBRIDGE.INB
N$12
  Top 0.5: HBRIDGE.SEL0 36.99,27.2 36.99,26.71 36.66,26.38 36.66,25.61 R26.1
N$13
  Top 0.5: HBRIDGE.PWM 36.91,31.01 36.9,31 35.95,31.95 R29.1
N$14
  Top 0.5: SWITCH.P$2 40.29,36.2 47.4,36.2 48.91,37.7 PWR-FET.4
N$15
  Top 0.5: R28.1 R31.2 35.98,28.46 HBRIDGE.CS
N$18
  Top 0.5: CURRENTSENSING.3 13.98,37.6 11.2,34.82 11.2,28.55 ACS-RF.2
N$19
  Top 0.5: HBRIDGE.10 HBRIDGE.OUTB 43.4,32.6 J1.2
N$20
  Top 0.5: R25.1 37.5,23.85 44.28,23.85 45.2,24.77 45.2,26.2 44.2,27.2 HBRIDGE.INA
PWM-VNH
  Top 0.5: U$2.B6 33.8,37.3 33.8,33.68 34.33,33.15 34.6,33.15 R29.2
SEL-VNH
  Top 0.5: U$2.F1 33.92,23.24 34.43,23.75 R26.2
V+  (via drill 0.4)
  Top 0.5: 1V8-REG.2 24.23,7.65 23.63,8.23 21.72,8.23 21.3,7.83 21.3,7.35 1V8REG-MISO.P$1 C2.1 R16.2 | IMU-A.P$6 2.93,12.06 2.79,12.06 2.02,11.28 2.02,5.47 2.59,4.89 4.18,4.89 IMU-B.P$6 6.34,2.67 6.34,1.89 7.46,0.78 v8.99,0.78
  Top 1: 1V8-REG.2 26.85,7.1 C4.1 28.45,0.8 v28.4,0.8
  Bottom 0.5: IMU-C.P$6 48.3,14.67 48.3,6.5 47.77,5.97 IMU-D.P$6 47,3.98 43.67,0.65 28.55,0.65 v28.4,0.8 28.38,0.78 v8.99,0.78
VOUT-ACS  (via drill 0.4)
  Top 0.5: 14.35,27.1 ACS-RF.1 | v21.3,27.1 14.35,27.1 | ACS-CF.1 13.65,27.1 14.35,27.1
  Bottom 0.5: U$2.B5 32.62,40.72 31.22,39.32 22.12,39.32 21.3,38.5 v21.3,27.1